# Altium schematic sheet DigitalOutput.SchDoc: Digital output
size A4; Author: eldar6776@hotmail.com; DrawnBy: Eldar Dediæ; Organization: PROVEN d.o.o.; Address1: Adema Buæe 102; Address2: 71000 Sarajevo; Address3: Federacija BiH; Address4: Bosna i Hercegovina; DocumentNumber: DE211213; Revision: 001; SheetNumber: 4; SheetTotal: 15; ProjectName: MIKSER SIROVINE
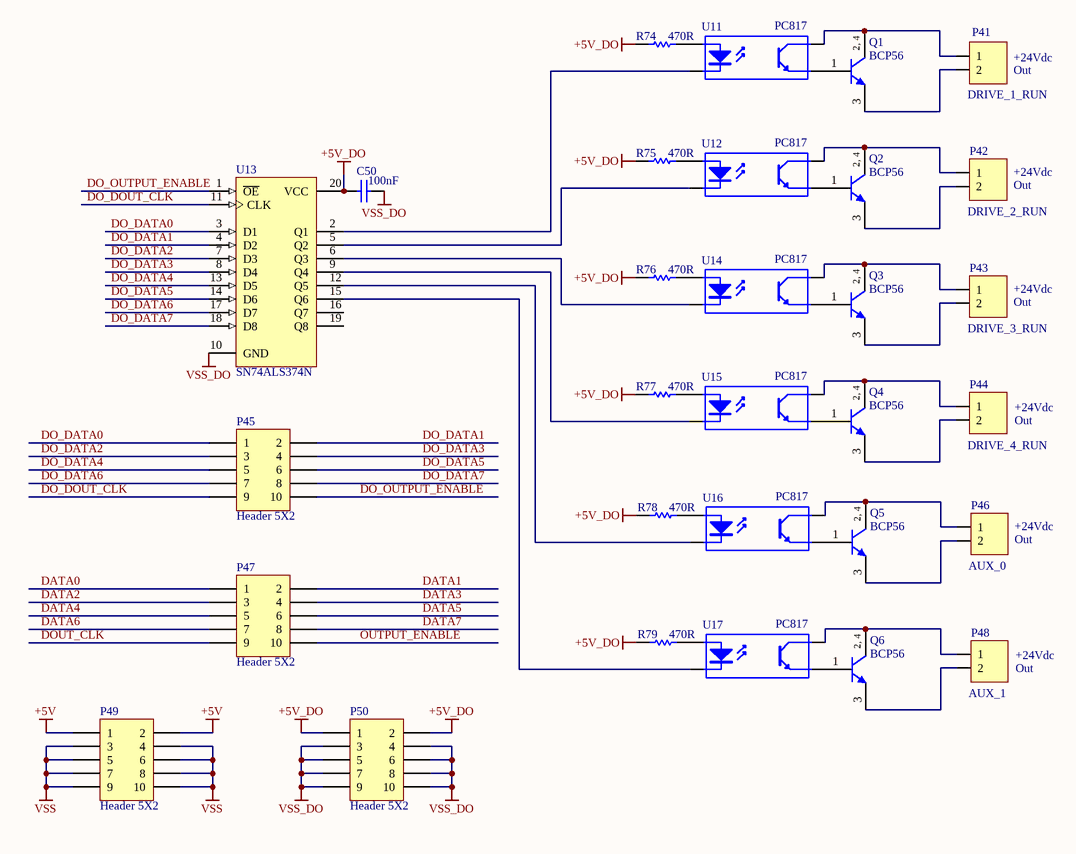
[diagram p0: DigitalOutput.SchDoc]

## Parts
C50  value 100nF  [1206]
P41  DRIVE_1_RUN  [TERMINAL BLOK 2]
P42  DRIVE_2_RUN  [TERMINAL BLOK 2]
P43  DRIVE_3_RUN  [TERMINAL BLOK 2]
P44  DRIVE_4_RUN  [TERMINAL BLOK 2]
P45  Header 5X2  [HDR2X5]
P46  AUX_0  [TERMINAL BLOK 2]
P47  Header 5X2  [HDR2X5]
P48  AUX_1  [TERMINAL BLOK 2]
P49  Header 5X2  [HDR2X5]
P50  Header 5X2  [HDR2X5]
Q1  BCP56  [SOT223_N]
Q2  BCP56  [SOT223_N]
Q3  BCP56  [SOT223_N]
Q4  BCP56  [SOT223_N]
Q5  BCP56  [SOT223_N]
Q6  BCP56  [SOT223_N]
R74  470R  [ERA-0805]
R75  470R  [ERA-0805]
R76  470R  [ERA-0805]
R77  470R  [ERA-0805]
R78  470R  [ERA-0805]
R79  470R  [ERA-0805]
U11  PC817  [DIP-4]
U12  PC817  [DIP-4]
U13  SN74ALS374N  [N020D]
U14  PC817  [DIP-4]
U15  PC817  [DIP-4]
U16  PC817  [DIP-4]
U17  PC817  [DIP-4]

## Nets
+5V: P49.1 P49.2
+5V_DO: C50.1 P50.1 P50.2 R74.2 R75.2 R76.2 R77.2 R78.2 R79.2 U13.20(VCC)
VSS: P49.3 P49.4 P49.5 P49.6 P49.7 P49.8 P49.9 P49.10
VSS_DO: C50.2 P50.3 P50.4 P50.5 P50.6 P50.7 P50.8 P50.9 P50.10 U13.10(GND)
DATA0: P47.1
DATA1: P47.2
DATA2: P47.3
DATA3: P47.4
DATA4: P47.5
DATA5: P47.6
DATA6: P47.7
DATA7: P47.8
DO_DATA0: P45.1 U13.3(D1)
DO_DATA1: P45.2 U13.4(D2)
DO_DATA2: P45.3 U13.7(D3)
DO_DATA3: P45.4 U13.8(D4)
DO_DATA4: P45.5 U13.13(D5)
DO_DATA5: P45.6 U13.14(D6)
DO_DATA6: P45.7 U13.17(D7)
DO_DATA7: P45.8 U13.18(D8)
DO_DOUT_CLK: P45.9 U13.11(CLK)
DO_OUTPUT_ENABLE: P45.10 U13.1(~{OE})
DOUT_CLK: P47.9
OUTPUT_ENABLE: P47.10
NetP41_1: P41.1 Q1.2(C) Q1.4(C) U11.4(C)
NetP41_2: P41.2 Q1.3(E)
NetP42_1: P42.1 Q2.2(C) Q2.4(C) U12.4(C)
NetP42_2: P42.2 Q2.3(E)
NetP43_1: P43.1 Q3.2(C) Q3.4(C) U14.4(C)
NetP43_2: P43.2 Q3.3(E)
NetP44_1: P44.1 Q4.2(C) Q4.4(C) U15.4(C)
NetP44_2: P44.2 Q4.3(E)
NetP46_1: P46.1 Q5.2(C) Q5.4(C) U16.4(C)
NetP46_2: P46.2 Q5.3(E)
NetP48_1: P48.1 Q6.2(C) Q6.4(C) U17.4(C)
NetP48_2: P48.2 Q6.3(E)
NetQ1_1: Q1.1(B) U11.3(E)
NetQ2_1: Q2.1(B) U12.3(E)
NetQ3_1: Q3.1(B) U14.3(E)
NetQ4_1: Q4.1(B) U15.3(E)
NetQ5_1: Q5.1(B) U16.3(E)
NetQ6_1: Q6.1(B) U17.3(E)
NetR74_1: R74.1 U11.1(A)
NetR75_1: R75.1 U12.1(A)
NetR76_1: R76.1 U14.1(A)
NetR77_1: R77.1 U15.1(A)
NetR78_1: R78.1 U16.1(A)
NetR79_1: R79.1 U17.1(A)
NetU11_2: U11.2(K) U13.2(Q1)
NetU12_2: U12.2(K) U13.5(Q2)
NetU13_6: U13.6(Q3) U14.2(K)
NetU13_9: U13.9(Q4) U15.2(K)
NetU13_12: U13.12(Q5) U16.2(K)
NetU13_15: U13.15(Q6) U17.2(K)

Not connected (* = marked no-connect by the designer): U13 16(Q7) 19(Q8)

## Notes on the sheet
- (near P41) Out
- (near P41) +24Vdc
- (near P42) +24Vdc
- (near P42) Out
- (near P43) Out
- (near P43) +24Vdc
- (near P44) Out
- (near P44) +24Vdc
- (near P46) Out
- (near P46) +24Vdc
- (near P48) Out
- (near P48) +24Vdc
- Title
- Size:
- Date:
- A4
- Number:
- Time:
- Revision:
- Sheet
- of
- File:
- (in symbol BCP56) 2, 4

## Library data of the parts
C50 = C1206: Ceramic Chip Capacitor - Standard; Published: 17-Jul-2002; LatestRevisionDate: 19-Mar-2004; LatestRevisionNote: Silkscreen size reduced.; DatasheetDocument: Mar-2001; PackageDocument: Mar-2001; PackageReference: 1206; Publisher: Altium Limited; Code_JEITA: 1206; Code_IPC: 3216 [1206]; ComponentLink1Description: Manufacturer Link; ComponentLink1URL: http://www.kemet.com/; ComponentLink2Description: Datasheet; ComponentLink2URL: http://www.kemet.com/kemet/web/homepage/kechome.nsf/vapubfilesname/F3102TA.pdf/$file/F3102TA.pdf
P41-P44 P46 P48 = Terminal blok 2 pina: Terminal blok 2
P45 P47 P49 P50 = Header 5X2: Header, 5-Pin, Dual row; LatestRevisionDate: 17-Jul-2002; LatestRevisionNote: Re-released for DXP Platform.; Publisher: Altium Limited
Q1-Q6 = BCP56: NPN Medium Power Transistor; Published: 17-Sep-2003; LatestRevisionDate: 12-Dec-2006; LatestRevisionNote: IPC-7351 Footprint Added.; DatasheetVersion: 10-Oct-2001; PackageVersion: Aug-2001; PackageReference: SOT223; Publisher: Altium Limited; PackageDescription: 4-Pin SOT-223 Package 2.3 mm Pitch, 7 mm Lead Span; ComponentLink1Description: Manufacturer Link; ComponentLink1URL: http://www.semiconductors.philips.com/; ComponentLink2Description: Datasheet; ComponentLink2URL: http://www.semiconductors.philips.com/acrobat/datasheets/BC639_BCP56_BCX56_7.pdf
R74-R79 = ERAS: Metal Film Thermosensitive Chip Resistor, 0.56 Ohm to 10k Ohm Range, 5% Tolerance, 0805 Size, 0.1 W; Note: If flow soldering, adjust pad width of PCB Footprint to 0.7 - 0.8 times the width of the resistor.; Published: 17-Dec-2003; LatestRevisionDate: 19-Mar-2004; LatestRevisionNote: Silkscreen size reduced.; PackageDocument: Mar-2003; PackageReference: ERA-0805; Publisher: Altium Limited; Code_IPC: 2012 [0805]; ComponentLink1Description: Manufacturer Link; ComponentLink1URL: http://www.panasonic.com/industrial/components/resistive_products.htm; ComponentLink2Description: Datasheet; ComponentLink2URL: http://www.panasonic.com/industrial/components/pdf/AOF0000CE1.pdf
U11 U12 U14-U17 = Optoisolator1: 4-Pin Phototransistor Optocoupler; Published: 24-Mar-1999; LatestRevisionDate: 04-Mar-2005; LatestRevisionNote: Sch pins 3 & 4 Swapped.; DatasheetVersion: Nov-2003; PackageReference: DIP-4; Publisher: Altium Limited
U13 = SN74ALS374N: Octal D-Type Edge-Triggered Flip-Flop with 3-State Outputs; Published: 8-Jun-2000; LatestRevisionDate: 04-Mar-2005; LatestRevisionNote: Stylized 3D Model Added.; DatasheetVersion: May-1986; PackageVersion: Oct-1995; PackageReference: N020D; Publisher: Altium Limited; PackageDescription: DIP; 20 Leads; Row Spacing 7.62 mm; Pitch 2.54 mm; ComponentLink1Description: Manufacturer Link; ComponentLink1URL: http://www.ti.com/